# Altium schematic sheet Sheet1.SchDoc: 8-Port USB Video Switch
size B; Author: Micah Dowty; DrawnBy: Micah Dowty; Revision: A
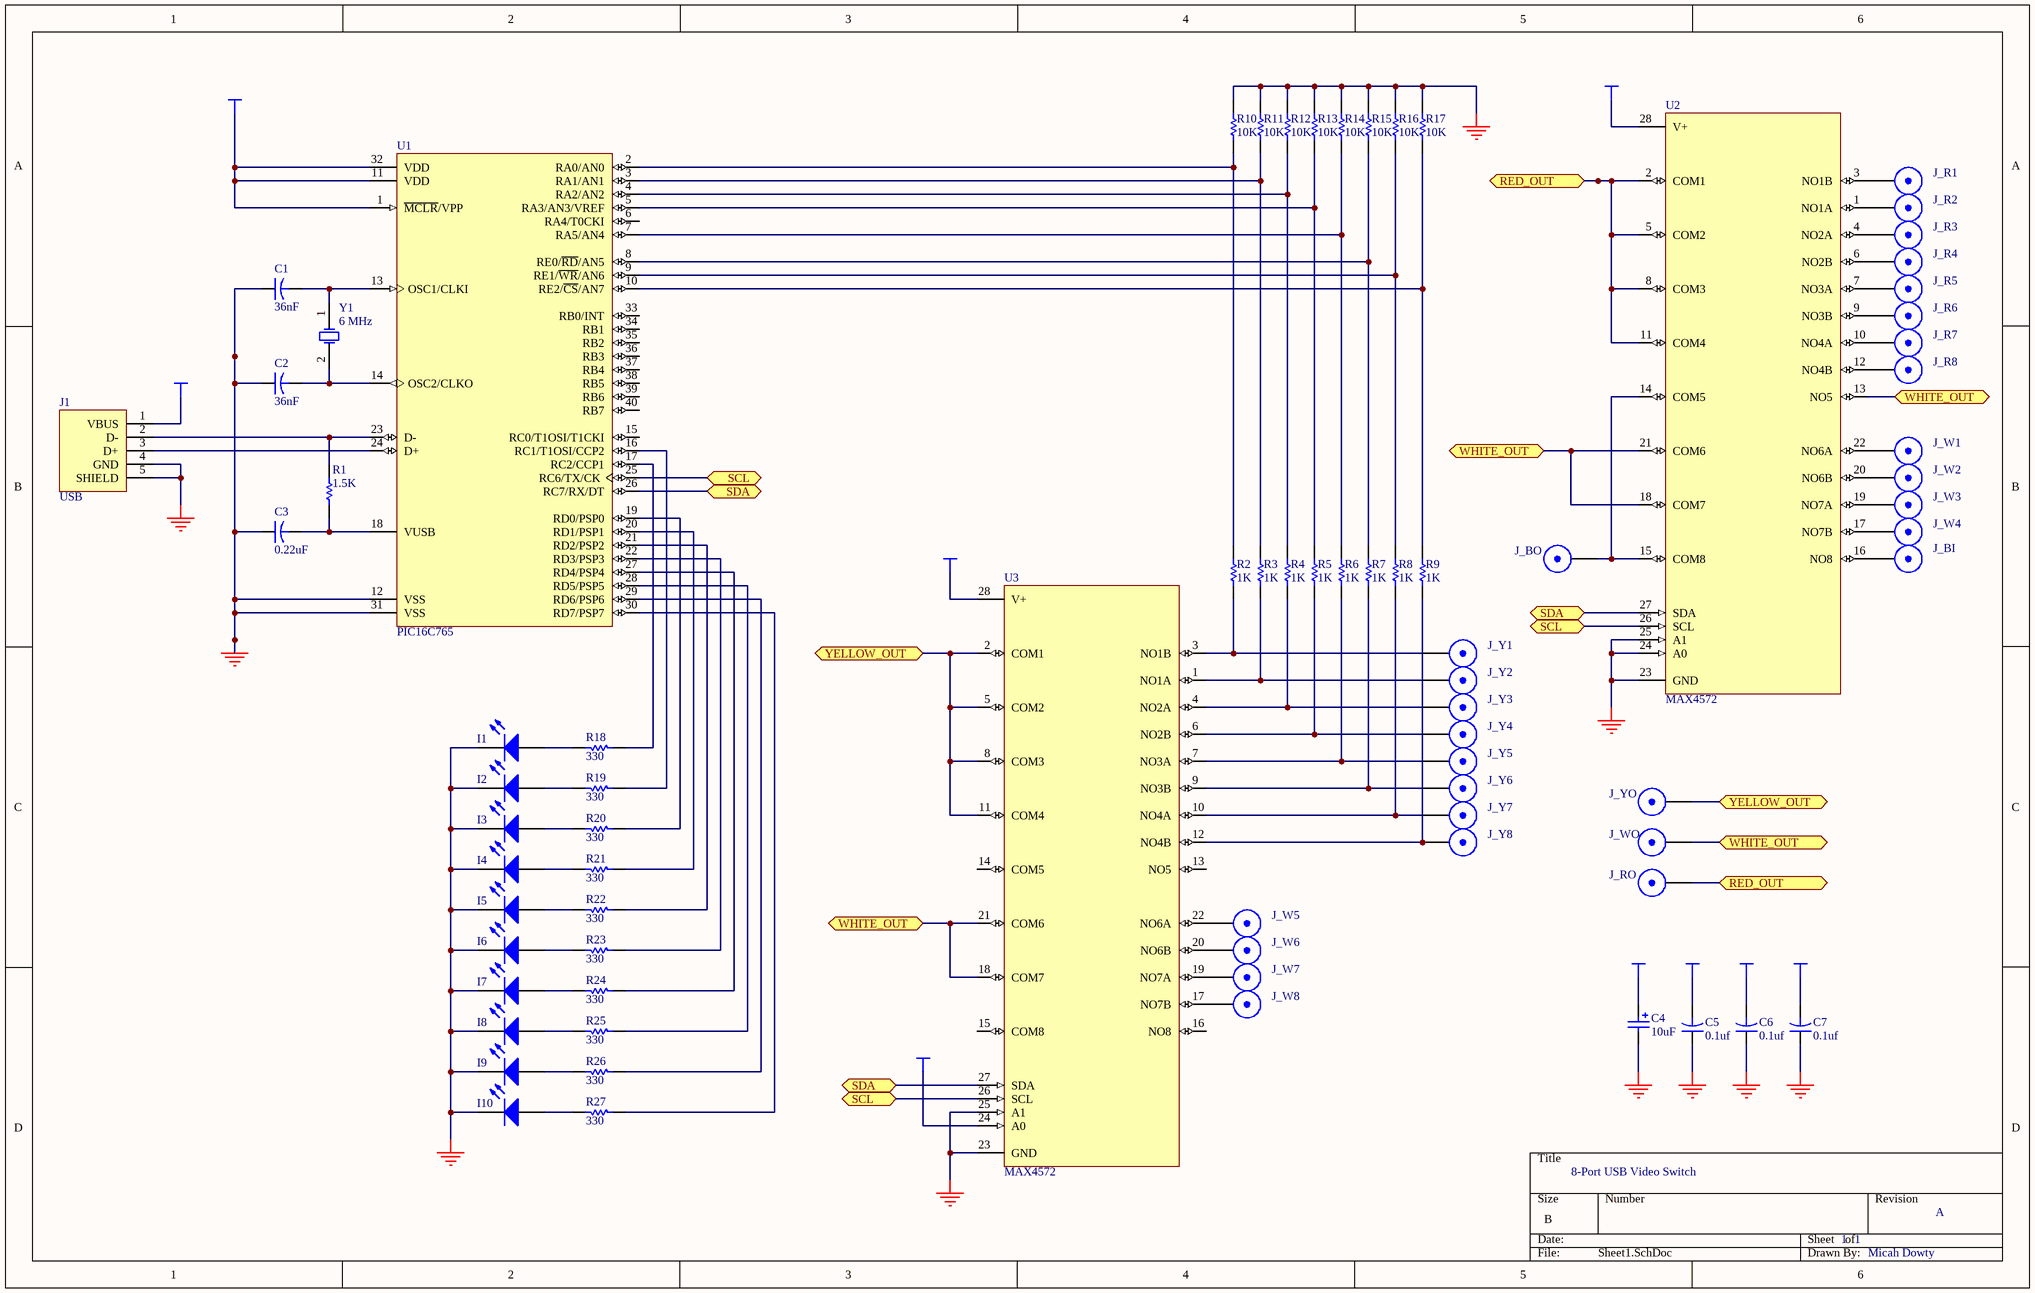
[diagram p0: Sheet1.SchDoc]

## Parts
C1  value 36nF  [CAPR5-4X5]  (hidden comment: Cap2)
C2  value 36nF  [CAPR5-4X5]  (hidden comment: Cap2)
C3  value 0.22uF  [CAPR5-4X5]
C4  10uF  [CAP-EE-1]
C5  value 0.1uf  [CAPR5-4X5]
C6  value 0.1uf  [CAPR5-4X5]
C7  value 0.1uf  [CAPR5-4X5]
I1  (no value)  [HDR1X2]
I2  (no value)  [HDR1X2]
I3  (no value)  [HDR1X2]
I4  (no value)  [HDR1X2]
I5  (no value)  [HDR1X2]
I6  (no value)  [HDR1X2]
I7  (no value)  [HDR1X2]
I8  (no value)  [HDR1X2]
I9  (no value)  [HDR1X2]
I10  (no value)  [HDR1X2]
J1  USB  [USB-TYPEB]
J_BI  (no value)  [RCJ-02X]
J_BO  (no value)  [RCJ-02X]
J_R1  (no value)  [RCJ-02X]
J_R2  (no value)  [RCJ-02X]
J_R3  (no value)  [RCJ-02X]
J_R4  (no value)  [RCJ-02X]
J_R5  (no value)  [RCJ-02X]
J_R6  (no value)  [RCJ-02X]
J_R7  (no value)  [RCJ-02X]
J_R8  (no value)  [RCJ-02X]
J_RO  (no value)  [RCJ-02X]
J_W1  (no value)  [RCJ-02X]
J_W2  (no value)  [RCJ-02X]
J_W3  (no value)  [RCJ-02X]
J_W4  (no value)  [RCJ-02X]
J_W5  (no value)  [RCJ-02X]
J_W6  (no value)  [RCJ-02X]
J_W7  (no value)  [RCJ-02X]
J_W8  (no value)  [RCJ-02X]
J_WO  (no value)  [RCJ-02X]
J_Y1  (no value)  [RCJ-02X]
J_Y2  (no value)  [RCJ-02X]
J_Y3  (no value)  [RCJ-02X]
J_Y4  (no value)  [RCJ-02X]
J_Y5  (no value)  [RCJ-02X]
J_Y6  (no value)  [RCJ-02X]
J_Y7  (no value)  [RCJ-02X]
J_Y8  (no value)  [RCJ-02X]
J_YO  (no value)  [RCJ-02X]
R1  value 1.5K  [AXIAL-0.3]  (hidden comment: Res1)
R2  value 1K  [AXIAL-0.3]
R3  value 1K  [AXIAL-0.3]
R4  value 1K  [AXIAL-0.3]
R5  value 1K  [AXIAL-0.3]
R6  value 1K  [AXIAL-0.3]
R7  value 1K  [AXIAL-0.3]
R8  value 1K  [AXIAL-0.3]
R9  value 1K  [AXIAL-0.3]
R10  value 10K  [AXIAL-0.3]
R11  value 10K  [AXIAL-0.3]
R12  value 10K  [AXIAL-0.3]
R13  value 10K  [AXIAL-0.3]
R14  value 10K  [AXIAL-0.3]
R15  value 10K  [AXIAL-0.3]
R16  value 10K  [AXIAL-0.3]
R17  value 10K  [AXIAL-0.3]
R18  value 330  [AXIAL-0.3]
R19  value 330  [AXIAL-0.3]
R20  value 330  [AXIAL-0.3]
R21  value 330  [AXIAL-0.3]
R22  value 330  [AXIAL-0.3]
R23  value 330  [AXIAL-0.3]
R24  value 330  [AXIAL-0.3]
R25  value 330  [AXIAL-0.3]
R26  value 330  [AXIAL-0.3]
R27  value 330  [AXIAL-0.3]
U1  PIC16C765  [DIP-40]
U2  MAX4572  [SSOP28]
U3  MAX4572  [SSOP28]
Y1  6 MHz  [BCY-W2/E4.7]

## Ports
RED_OUT, SCL, SDA, WHITE_OUT, YELLOW_OUT

## Nets
GND: C1.1 C2.1 C3.1 C4.2 C5.1 C6.1 C7.1 I1.2(K) I2.2(K) I3.2(K) I4.2(K) I5.2(K) I6.2(K) I7.2(K) I8.2(K) I9.2(K) I10.2(K) J1.4(GND) J1.5(SHIELD) J_BI.2(Y) J_BO.2(Y) J_R1.2(Y) J_R2.2(Y) J_R3.2(Y) J_R4.2(Y) J_R5.2(Y) J_R6.2(Y) J_R7.2(Y) J_R8.2(Y) J_RO.2(Y) J_W1.2(Y) J_W2.2(Y) J_W3.2(Y) J_W4.2(Y) J_W5.2(Y) J_W6.2(Y) J_W7.2(Y) J_W8.2(Y) J_WO.2(Y) J_Y1.2(Y) J_Y2.2(Y) J_Y3.2(Y) J_Y4.2(Y) J_Y5.2(Y) J_Y6.2(Y) J_Y7.2(Y) J_Y8.2(Y) J_YO.2(Y) R10.2 R11.2 R12.2 R13.2 R14.2 R15.2 R16.2 R17.2 U1.12(VSS) U1.31(VSS) U2.23(GND) U2.24(A0) U2.25(A1) U3.23(GND) U3.25(A1)
VCC: C4.1 C5.2 C6.2 C7.2 J1.1(VBUS) U1.1(~{MCLR}/VPP) U1.11(VDD) U1.32(VDD) U2.28(V+) U3.24(A0) U3.28(V+)
RED_OUT: J_RO.1(X) U2.2(COM1) U2.5(COM2) U2.8(COM3) U2.11(COM4) ; port RED_OUT
SCL: U1.25(RC6/TX/CK) U2.26(SCL) U3.26(SCL) ; port SCL
SDA: U1.26(RC7/RX/DT) U2.27(SDA) U3.27(SDA) ; port SDA
WHITE_OUT: J_WO.1(X) U2.13(NO5) U2.18(COM7) U2.21(COM6) U3.18(COM7) U3.21(COM6) ; port WHITE_OUT
YELLOW_OUT: J_YO.1(X) U3.2(COM1) U3.5(COM2) U3.8(COM3) U3.11(COM4) ; port YELLOW_OUT
NetC1_2: C1.2 U1.13(OSC1/CLKI) Y1.1(OSC1)
NetC2_2: C2.2 U1.14(OSC2/CLKO) Y1.2(OSC2)
NetC3_2: C3.2 R1.1 U1.18(VUSB)
NetI1_1: I1.1(A) R18.1
NetI2_1: I2.1(A) R19.1
NetI3_1: I3.1(A) R20.1
NetI4_1: I4.1(A) R21.1
NetI5_1: I5.1(A) R22.1
NetI6_1: I6.1(A) R23.1
NetI7_1: I7.1(A) R24.1
NetI8_1: I8.1(A) R25.1
NetI9_1: I9.1(A) R26.1
NetI10_1: I10.1(A) R27.1
NetJ1_2: J1.2(D-) R1.2 U1.23(D-)
NetJ1_3: J1.3(D+) U1.24(D+)
NetJ_BI_1: J_BI.1(X) U2.16(NO8)
NetJ_BO_1: J_BO.1(X) U2.14(COM5) U2.15(COM8)
NetJ_R1_1: J_R1.1(X) U2.3(NO1B)
NetJ_R2_1: J_R2.1(X) U2.1(NO1A)
NetJ_R3_1: J_R3.1(X) U2.4(NO2A)
NetJ_R4_1: J_R4.1(X) U2.6(NO2B)
NetJ_R5_1: J_R5.1(X) U2.7(NO3A)
NetJ_R6_1: J_R6.1(X) U2.9(NO3B)
NetJ_R7_1: J_R7.1(X) U2.10(NO4A)
NetJ_R8_1: J_R8.1(X) U2.12(NO4B)
NetJ_W1_1: J_W1.1(X) U2.22(NO6A)
NetJ_W2_1: J_W2.1(X) U2.20(NO6B)
NetJ_W3_1: J_W3.1(X) U2.19(NO7A)
NetJ_W4_1: J_W4.1(X) U2.17(NO7B)
NetJ_W5_1: J_W5.1(X) U3.22(NO6A)
NetJ_W6_1: J_W6.1(X) U3.20(NO6B)
NetJ_W7_1: J_W7.1(X) U3.19(NO7A)
NetJ_W8_1: J_W8.1(X) U3.17(NO7B)
NetJ_Y1_1: J_Y1.1(X) J_Y2.1(X) J_Y3.1(X) J_Y4.1(X) J_Y5.1(X) J_Y6.1(X) J_Y7.1(X) J_Y8.1(X) R2.1 R3.1 R4.1 R5.1 R6.1 R7.1 R8.1 R9.1 U3.1(NO1A) U3.3(NO1B) U3.4(NO2A) U3.6(NO2B) U3.7(NO3A) U3.9(NO3B) U3.10(NO4A) U3.12(NO4B)
NetR2_2: R2.2 R10.1 U1.2(RA0/AN0)
NetR3_2: R3.2 R11.1 U1.3(RA1/AN1)
NetR4_2: R4.2 R12.1 U1.4(RA2/AN2)
NetR5_2: R5.2 R13.1 U1.5(RA3/AN3/VREF)
NetR6_2: R6.2 R14.1 U1.7(RA5/AN4)
NetR7_2: R7.2 R15.1 U1.8(RE0/~{RD}/AN5)
NetR8_2: R8.2 R16.1 U1.9(RE1/~{WR}/AN6)
NetR9_2: R9.2 R17.1 U1.10(RE2/~{CS}/AN7)
NetR18_2: R18.2 U1.17(RC2/CCP1)
NetR19_2: R19.2 U1.16(RC1/T1OSI/CCP2)
NetR20_2: R20.2 U1.19(RD0/PSP0)
NetR21_2: R21.2 U1.20(RD1/PSP1)
NetR22_2: R22.2 U1.21(RD2/PSP2)
NetR23_2: R23.2 U1.22(RD3/PSP3)
NetR24_2: R24.2 U1.27(RD4/PSP4)
NetR25_2: R25.2 U1.28(RD5/PSP5)
NetR26_2: R26.2 U1.29(RD6/PSP6)
NetR27_2: R27.2 U1.30(RD7/PSP7)

Not connected (* = marked no-connect by the designer): U1 6(RA4/T0CKI) 15(RC0/T1OSI/T1CKI) 33(RB0/INT) 34(RB1) 35(RB2) 36(RB3) 37(RB4) 38(RB5) 39(RB6) 40(RB7); U3 13(NO5) 14(COM5) 15(COM8) 16(NO8)

## Notes on the sheet
- 8-Port USB Video Switch
- 1
- A
- Micah Dowty

## Library data of the parts
C1-C3 C5-C7 = Cap2: Capacitor; Manufacturer: Generic Components; Class I: Passive; Published: 23-Sep-2002; Publisher: Altium Limited; Class II: Capacitor
C4 = Cap Pol1: Polarized Capacitor (Radial); Manufacturer: Generic Components; Class I: Passive; Published: 8-Jun-2000; Revision: July-2002: Re-released for DXP Platform.; Publisher: Altium Limited; Class II: Capacitor; Value: 10uF
I1-I10 = LED1: Typical RED GaAs LED; Manufacturer: Generic Components; Class I: Optoelectronic; Published: 8-Jun-2000; Revision: July-2002: Re-released for DXP Platform.; Publisher: Altium Limited; Class II: LED
J1 = USB Type B: Header, 4-Pin; Manufacturer: Generic Components; Class I: Connector; Revision: July-2002: Re-released for DXP Platform.; Publisher: Altium Limited
J_BI J_BO J_R1-J_R8 J_RO J_W1-J_W8 J_WO J_Y1-J_Y8 J_YO = RCA-COMPACT: RCA Connector; Manufacturer: Generic Components; Revision: Tweaked schematic symbol, changed PCB layout; Class I: Connector
R1-R27 = Res1: Resistor; Manufacturer: Generic Components; Class I: Passive; Published: 8-Jun-2000; Revision: July-2002: Re-released for DXP Platform.; Publisher: Altium Limited; Class II: Resistor
U1 = PIC16C765: EPROM-Based 8-Bit CMOS Microcontroller with USB; Manufacturer: Microchip; Revision: Modified for PIC16C745 by Micah Dowty; Package Reference: P40; Class I: Microcontroller; Class II: 8-bit
U2 U3 = MAX4572: Serially Controlled, Clickless Audio/Video switch; Manufacturer: Maxim; Revision: Initially drawn- Micah Dowty; Class I: Audio/Video Switch; Class II: Serially Controlled
Y1 = XTAL: Crystal Oscillator; Manufacturer: Generic Components; Published: 8-Jun-2000; Revision: July-2002: Re-released for DXP Platform.; Publisher: Altium Limited; Class I: Oscillator; Class II: Crystal Oscillator